# Altium schematic sheet hitmouse.SchDoc
size A4
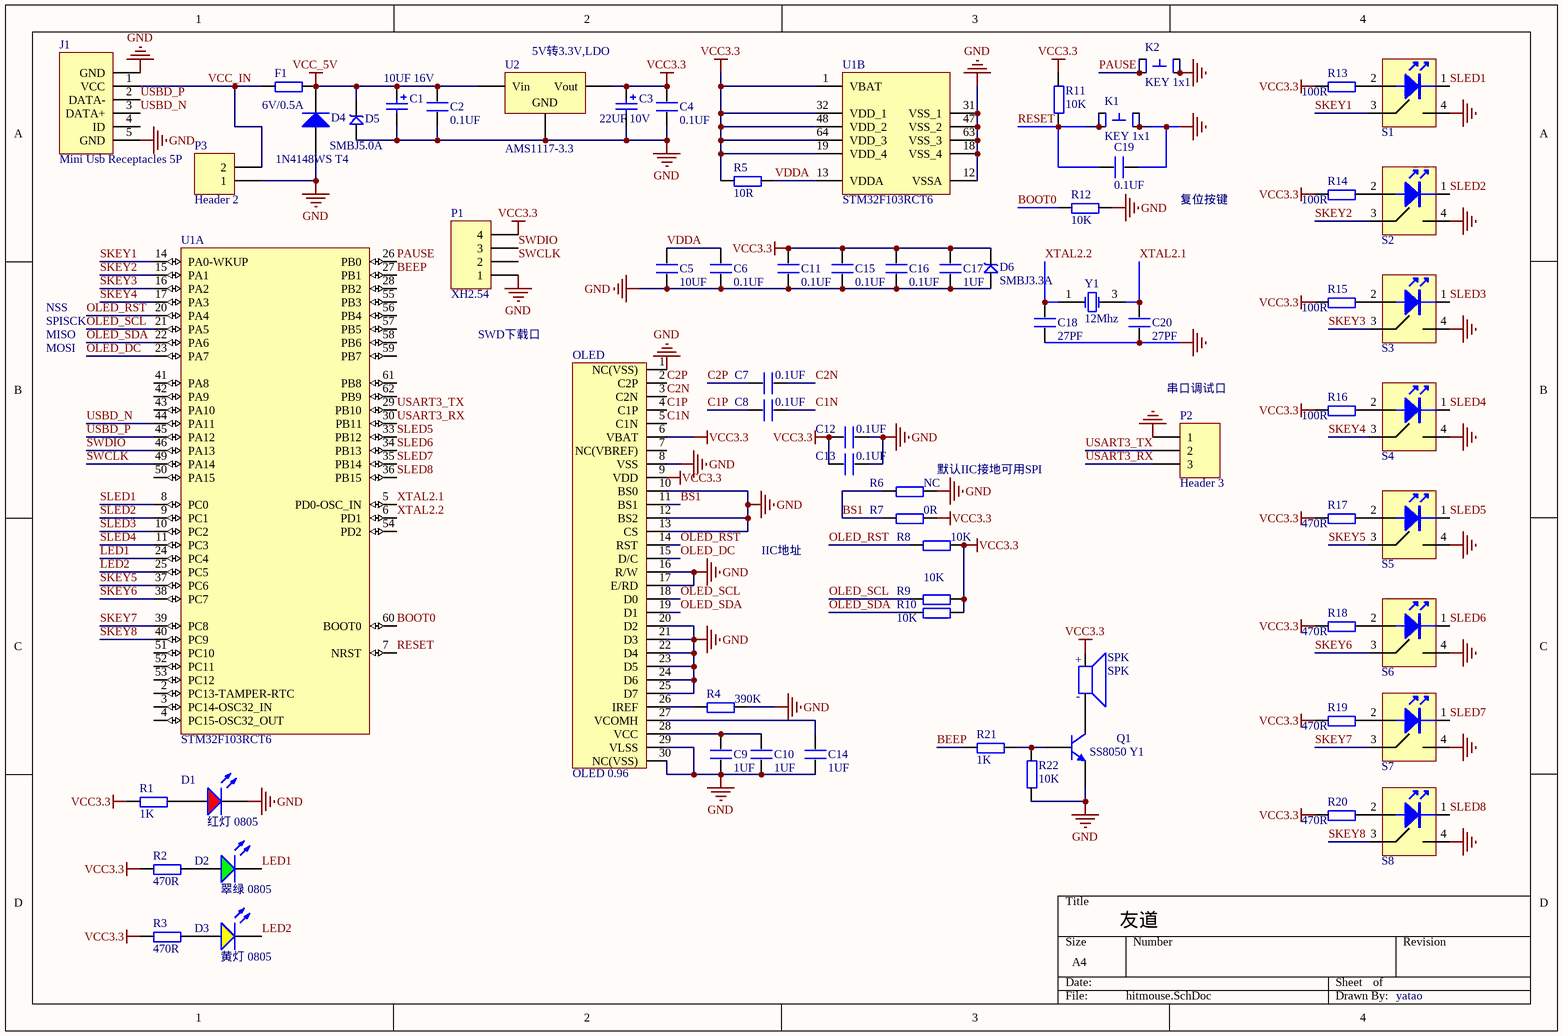
[diagram p0: hitmouse.SchDoc]

## Parts
*  LOGO  [LOGO-14MM]  (value not drawn)
C1  10UF 16V  [CASE-A_3216]
C2  0.1UF  [0805_C]
C3  22UF 10V  [CASE-A_3216]
C4  0.1UF  [0805_C]
C5  10UF  [0805_C]
C6  0.1UF  [0805_C]
C7  0.1UF  [0805_C]
C8  0.1UF  [0805_C]
C9  1UF  [0805_C]
C10  1UF  [0805_C]
C11  0.1UF  [0805_C]
C12  0.1UF  [0805_C]
C13  0.1UF  [0805_C]
C14  1UF  [0805_C]
C15  0.1UF  [0805_C]
C16  0.1UF  [0805_C]
C17  1UF  [0805_C]
C18  27PF  [0805_C]
C19  0.1UF  [0805_C]
C20  27PF  [0805_C]
D1  红灯 0805  [0805_LED_S1]
D2  翠绿 0805  [0805_LED_S1]
D3  黄灯 0805  [0805_LED_S1]
D4  1N4148WS T4  [SOD-323]
D5  SMBJ5.0A  [SMBJ]
D6  SMBJ3.3A  [SMBJ]
F1  6V/0.5A  [0805_R]
J1  Mini Usb Receptacles 5P  [USB Micro MUP U513 F]
K1  KEY 1x1  [BUT 6mm SMT]
K2  KEY 1x1  [BUT 6mm SMT]
OLED  OLED 0.96  [0.96_OLED]
P1  XH2.54  [XH2.54-LI-4P]
P2  Header 3  [HDR1X3]
P3  Header 2  [HDR1X2]
Q1  SS8050 Y1  [SOT-23(SOT-23-3)]
R1  1K  [0805_R]
R2  470R  [0805_R]
R3  470R  [0805_R]
R4  390K  [0805_R]
R5  10R  [0805_R]
R6  NC  [0805_R]
R7  0R  [0805_R]
R8  10K  [0805_R]
R9  10K  [0805_R]
R10  10K  [0805_R]
R11  10K  [0805_R]
R12  10K  [0805_R]
R13  100R  [0805_R]
R14  100R  [0805_R]
R15  100R  [0805_R]
R16  100R  [0805_R]
R17  470R  [0805_R]
R18  470R  [0805_R]
R19  470R  [0805_R]
R20  470R  [0805_R]
R21  1K  [0805_R]
R22  10K  [0805_R]
S1  12X12轻触带灯开关  [TSG010]  (value not drawn)
S2  12X12轻触带灯开关  [TSG010]  (value not drawn)
S3  12X12轻触带灯开关  [TSG010]  (value not drawn)
S4  12X12轻触带灯开关  [TSG010]  (value not drawn)
S5  12X12轻触带灯开关  [TSG010]  (value not drawn)
S6  12X12轻触带灯开关  [TSG010]  (value not drawn)
S7  12X12轻触带灯开关  [TSG010]  (value not drawn)
S8  12X12轻触带灯开关  [TSG010]  (value not drawn)
SPK  SPK  [SPAKER F12]
U1  STM32F103RCT6  [LQFP-64_10x10x05P]  (parts A,B of 2)
U2  AMS1117-3.3  [SOT-223]
Y1  12Mhz  [SMD-3225_4P]
yatao  NC  [Y-LOGO-8]  (value not drawn)

## Nets
GND: C1.2 C2.1 C3.2 C4.1 C5.1 C6.1 C9.1 C10.1 C11.1 C12.1 C13.1 C14.1 C15.1 C16.1 C17.1 C18.2 C19.1 C20.2 D1.K D4.1(A) D5.1 D6.1 J1.0(GND) J1.5(GND) K1.3 K1.4 K2.3 K2.4 OLED.1(NC(VSS)) OLED.8(VSS) OLED.10(BS0) OLED.12(BS2) OLED.13(CS) OLED.16(R/W) OLED.17(E/RD) OLED.20(D2) OLED.21(D3) OLED.22(D4) OLED.23(D5) OLED.24(D6) OLED.25(D7) OLED.29(VLSS) OLED.30(NC(VSS)) P1.1 P2.1 P3.1 Q1.2(E) R4.2 R6.2 R12.2 R22.1 S1.4 S2.4 S3.4 S4.4 S5.4 S6.4 S7.4 S8.4 U1.12(VSSA) U1.18(VSS_4) U1.31(VSS_1) U1.47(VSS_2) U1.63(VSS_3) U2.1(GND)
VCC3.3: C3.1 C4.2 C11.2 C12.2 C13.2 C15.2 C16.2 C17.2 D6.2 OLED.6(VBAT) OLED.9(VDD) P1.4 R1.1 R2.1 R3.1 R5.1 R7.2 R8.2 R9.2 R10.2 R11.2 R13.1 R14.1 R15.1 R16.1 R17.1 R18.1 R19.1 R20.1 SPK.1 U1.1(VBAT) U1.19(VDD_4) U1.32(VDD_1) U1.48(VDD_2) U1.64(VDD_3) U2.2(Vout)
VCC_5V: C1.1 C2.2 D4.2(K) D5.2 F1.2 U2.3(Vin)
BEEP: R21.1 U1.27(PB1)
BOOT0: R12.1 U1.60(BOOT0)
BS1: OLED.11(BS1) R6.1 R7.1
C1N: C8.1 OLED.5(C1N)
C1P: C8.2 OLED.4(C1P)
C2N: C7.1 OLED.3(C2N)
C2P: C7.2 OLED.2(C2P)
LED1: D2.K U1.24(PC4)
LED2: D3.K U1.25(PC5)
OLED_DC: OLED.15(D/C) U1.23(PA7)
OLED_RST: OLED.14(RST) R8.1 U1.20(PA4)
OLED_SCL: OLED.18(D0) R9.1 U1.21(PA5)
OLED_SDA: OLED.19(D1) R10.1 U1.22(PA6)
PAUSE: K2.1 K2.2 U1.26(PB0)
RESET: C19.2 K1.1 K1.2 R11.1 U1.7(NRST)
SKEY1: S1.3 U1.14(PA0-WKUP)
SKEY2: S2.3 U1.15(PA1)
SKEY3: S3.3 U1.16(PA2)
SKEY4: S4.3 U1.17(PA3)
SKEY5: S5.3 U1.37(PC6)
SKEY6: S6.3 U1.38(PC7)
SKEY7: S7.3 U1.39(PC8)
SKEY8: S8.3 U1.40(PC9)
SLED1: S1.1 U1.8(PC0)
SLED2: S2.1 U1.9(PC1)
SLED3: S3.1 U1.10(PC2)
SLED4: S4.1 U1.11(PC3)
SLED5: S5.1 U1.33(PB12)
SLED6: S6.1 U1.34(PB13)
SLED7: S7.1 U1.35(PB14)
SLED8: S8.1 U1.36(PB15)
SWCLK: P1.2 U1.49(PA14)
SWDIO: P1.3 U1.46(PA13)
USART3_RX: P2.3 U1.30(PB11)
USART3_TX: P2.2 U1.29(PB10)
USBD_N: J1.3(DATA+) U1.44(PA11)
USBD_P: J1.2(DATA-) U1.45(PA12)
VCC_IN: F1.1 J1.1(VCC) P3.2
VDDA: C5.2 C6.2 R5.2 U1.13(VDDA)
XTAL2.1: C20.1 U1.5(PD0-OSC_IN) Y1.3(OSC2)
XTAL2.2: C18.1 U1.6(PD1) Y1.1(OSC1)
NetC9_2: C9.2 C10.2 OLED.28(VCC)
NetC14_2: C14.2 OLED.27(VCOMH)
NetD1_A: D1.A R1.2
NetD2_A: D2.A R2.2
NetD3_A: D3.A R3.2
NetOLED_26: OLED.26(IREF) R4.1
NetQ1_1: Q1.1(B) R21.2 R22.2
NetQ1_3: Q1.3(C) SPK.2
NetR13_2: R13.2 S1.2
NetR14_2: R14.2 S2.2
NetR15_2: R15.2 S3.2
NetR16_2: R16.2 S4.2
NetR17_2: R17.2 S5.2
NetR18_2: R18.2 S6.2
NetR19_2: R19.2 S7.2
NetR20_2: R20.2 S8.2

Not connected (* = marked no-connect by the designer): J1 4(ID); OLED 7(NC(VBREF)); U1 2(PC13-TAMPER-RTC) 3(PC14-OSC32_IN) 4(PC15-OSC32_OUT) 28(PB2) 41(PA8) 42(PA9) 43(PA10) 50(PA15) 51(PC10) 52(PC11) 53(PC12) 54(PD2) 55(PB3) 56(PB4) 57(PB5) 58(PB6) 59(PB7) 61(PB8) 62(PB9)

## Notes on the sheet
- (near U2) 5V转3.3V,LDO
- 复位按键
- NSS
- MISO
- MOSI
- SPISCK
- SWD下载口
- 串口调试口
- (near R6) 默认IIC接地可用SPI
- IIC地址
- (in symbol LOGO) 友道
- (in symbol SPK) +; -

## Library data of the parts
* = LOGO: YOODAO-LOGO不焊接
C1 C3 = C3216,A型钽电容: 钽电容A; ComponentLink1Description: 供应商链接; ComponentLink1URL: http://www.szlcsc.com/product/details_7643.html; Package: 3216; Supplier: LC; SuppliersPartNumber: C7171
C2 C4-C20 = C0805: 0805电容
D1 = 0805 红灯: 发光二极管; ComponentLink1Description: 供应商链接; ComponentLink1URL: http://www.szlcsc.com/product/details_2668.html; Package: 0805; Supplier: LC; SuppliersPartNumber: C2295
D2 = 0805 翠绿: 发光二极管; ComponentLink1Description: 供应商链接; ComponentLink1URL: http://www.szlcsc.com/product/details_2670.html; Package: 0805; Supplier: LC; SuppliersPartNumber: C2297
D3 = 0805 黄灯: 发光二极管; ComponentLink1Description: 供应商链接; ComponentLink1URL: http://www.szlcsc.com/product/details_2669.html; Package: 0805; Supplier: LC; SuppliersPartNumber: C2296
D4 = SOD-323 1N4148WS T4: 二极管; ComponentLink1Description: 供应商链接; ComponentLink1URL: http://www.szlcsc.com/product/details_2485.html; Package: SOD-323; Supplier: LC; SuppliersPartNumber: C2128
D5 D6 = SMBJ: TVS
F1 = R0805: 0805贴片自恢复保险丝
J1 = USB Mini: Micro USB 母座 5P 全贴有柱
K1 K2 = KEY 1x1: 贴片轻触按键6*6*5
OLED = OLED: 0.96寸OLED贴片
P1 = XH2.54: XH2.54 直/弯 带围墙; LatestRevisionDate: 17-Jul-2002; LatestRevisionNote: Re-released for DXP Platform.; Publisher: Altium Limited
P2 = Header 3: 2.54直针; LatestRevisionDate: 17-Jul-2002; LatestRevisionNote: Re-released for DXP Platform.; Publisher: Altium Limited
P3 = Header 2: Header, 2-Pin; LatestRevisionDate: 17-Jul-2002; LatestRevisionNote: Re-released for DXP Platform.; Publisher: Altium Limited
Q1 = NPN: NPN三极管SOT23; ComponentLink1Description: 供应商链接; ComponentLink1URL: http://www.szlcsc.com/product/details_2507.html; Package: SOT-23; Supplier: LC; SuppliersPartNumber: C2150
R1-R22 = R0805: 0805贴片电阻
S1-S8 = LED开关12X12: 12X12按键带灯直插
SPK = SPK: 3.3V无源蜂鸣器，脚距7mm
U1 = STM32F103RCT6: ARM; ComponentLink1Description: 供应商链接; ComponentLink1URL: http://www.szlcsc.com/product/details_8815.html; Package: LQFP-64_10x10x05P; Supplier: LC; SuppliersPartNumber: C8323
U2 = SOT-223 AMS1117-3.3: 低压差线性稳压(LDO); ComponentLink1Description: 供应商链接; ComponentLink1URL: http://www.szlcsc.com/product/details_6652.html; Package: SOT-223; Supplier: LC; SuppliersPartNumber: C6186
Y1 = XTAL-3225_4P: 2P无源贴片晶振3225; ComponentLink1Description: 供应商链接; ComponentLink1URL: http://www.szlcsc.com/product/details_9526.html; Package: SMD-3225_4P; Supplier: LC; SuppliersPartNumber: C9006
yatao = Yatao: LOGO，不焊接